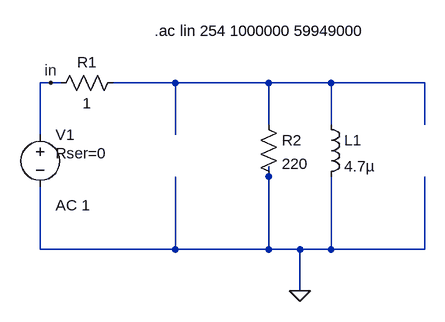
[diagram p0: schematic Test load 4u7H220.asc]
Test load 4u7H220.asc, the LTspice schematic file:
Version 4
SHEET 1 880 680
WIRE -32 64 -48 64
WIRE -16 64 -32 64
WIRE 160 64 64 64
WIRE 304 64 160 64
WIRE 400 64 304 64
WIRE 544 64 400 64
WIRE 304 128 304 64
WIRE 400 128 400 64
WIRE 544 128 544 64
WIRE -48 144 -48 64
WIRE 160 144 160 64
WIRE 304 208 304 192
WIRE -48 320 -48 224
WIRE 160 320 160 208
WIRE 160 320 -48 320
WIRE 304 320 304 208
WIRE 304 320 160 320
WIRE 352 320 304 320
WIRE 400 320 400 208
WIRE 400 320 352 320
WIRE 544 320 544 208
WIRE 544 320 400 320
WIRE 352 384 352 320
FLAG 352 384 0
FLAG -32 64 in
SYMBOL ind 384 112 R0
SYMATTR InstName L1
SYMATTR Value 4.7µ
SYMATTR SpiceLine Rser=0.5
SYMBOL voltage -48 128 R0
WINDOW 123 24 124 Left 2
WINDOW 39 24 44 Left 2
SYMATTR Value2 AC 1
SYMATTR SpiceLine Rser=0
SYMATTR InstName V1
SYMATTR Value ""
SYMBOL res 80 48 R90
WINDOW 0 0 56 VBottom 2
WINDOW 3 32 56 VTop 2
SYMATTR InstName R1
SYMATTR Value 1
SYMBOL res 288 112 R0
SYMATTR InstName R2
SYMATTR Value 220
TEXT 128 -16 Left 2 !.ac lin 254 1000000 59949000

The netlist it stands for:
* Test load 4u7H220.asc
L1 N001 0 4.7µ Rser=0.5
V1 in 0 AC 1 Rser=0
R1 N001 in 1
R2 N001 0 220
.ac lin 254 1000000 59949000
.backanno
.end